# EAGLE schematic driver ckt_4_bjtTH (EAGLE 8.4.3)
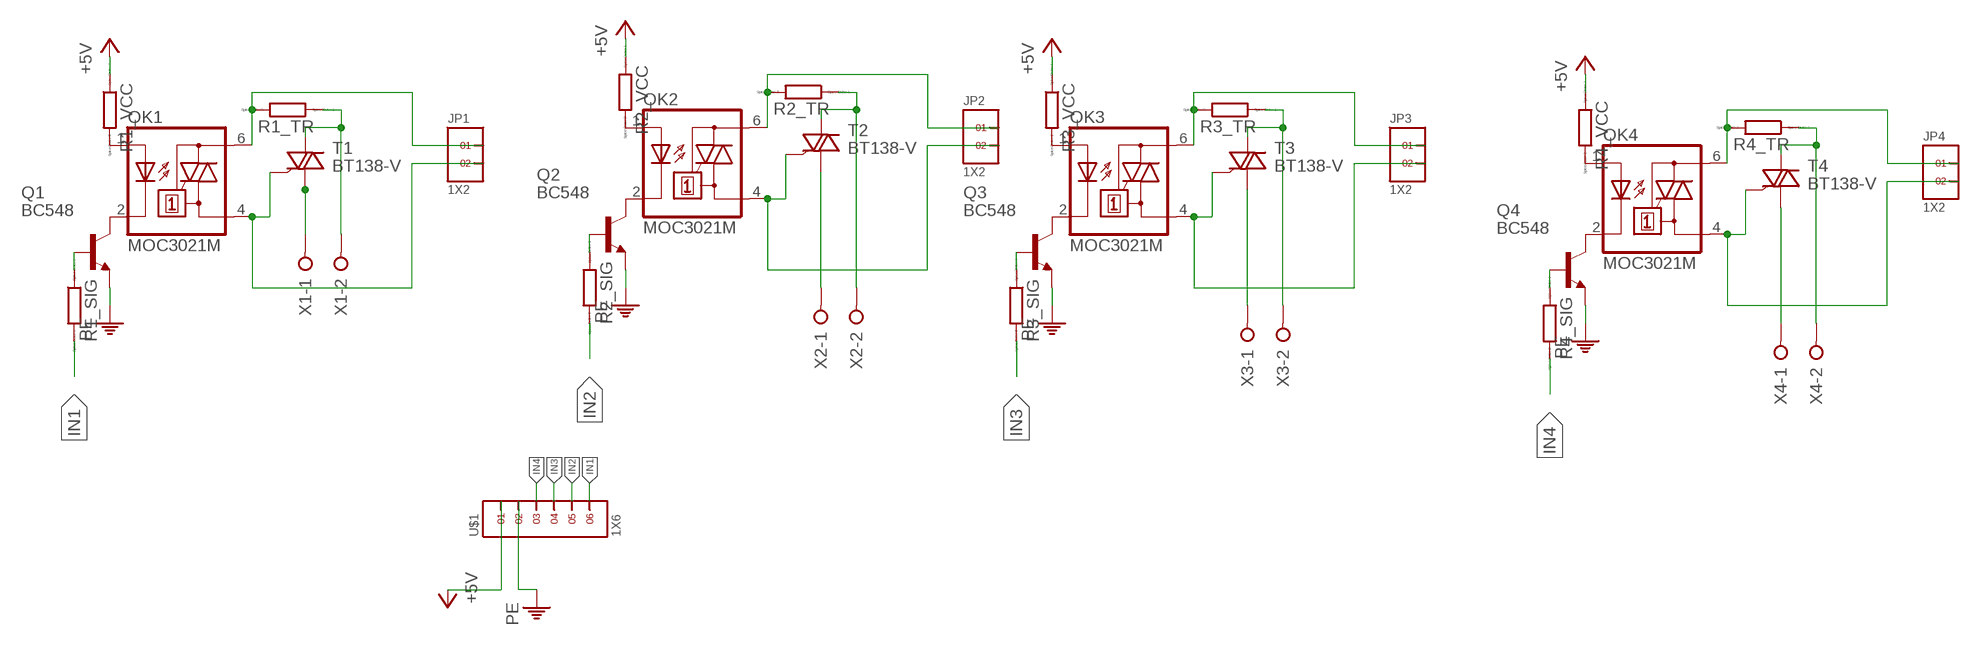
[diagram p0: schematic, sheet 1]

## Parts
JP1  1X2  [1X2]
JP2  1X2  [1X2]
JP3  1X2  [1X2]
JP4  1X2  [1X2]
OK1  MOC3021M  [DIL06]
OK2  MOC3021M  [DIL06]
OK3  MOC3021M  [DIL06]
OK4  MOC3021M  [DIL06]
Q1  BC548  [TO92-EBC]
Q2  BC548  [TO92-EBC]
Q3  BC548  [TO92-EBC]
Q4  BC548  [TO92-EBC]
R1_SIG  RR1206  [R1206]
R1_TR  RR1206  [R1206]
R1_VCC  RR1206  [R1206]
R2_SIG  RR1206  [R1206]
R2_TR  RR1206  [R1206]
R2_VCC  RR1206  [R1206]
R3_SIG  RR1206  [R1206]
R3_TR  RR1206  [R1206]
R3_VCC  RR1206  [R1206]
R4_SIG  RR1206  [R1206]
R4_TR  RR1206  [R1206]
R4_VCC  RR1206  [R1206]
T1  BT138-V  [TO220BV]
T2  BT138-V  [TO220BV]
T3  BT138-V  [TO220BV]
T4  BT138-V  [TO220BV]
U$1  1X6  [1X6]
X1  W237-02P  [W237-132]
X2  W237-02P  [W237-132]
X3  W237-02P  [W237-132]
X4  W237-02P  [W237-132]

## Nets
+5V: R1_VCC.1 R2_VCC.1 R3_VCC.1 R4_VCC.1 U$1.1
IN1: R1_SIG.2 U$1.6
IN2: R2_SIG.2 U$1.5
IN3: R3_SIG.2 U$1.4
IN4: R4_SIG.2 U$1.3
N$1: JP1.1 OK1.6(A2) R1_TR.2
N$2: R1_TR.1 T1.T2(A2) X1.2
N$3: T1.T1(A1) X1.1
N$4: OK1.1(A) R1_VCC.2
N$5: OK1.2(C) Q1.C
N$6: JP2.2 OK2.4(A1) T2.G
N$7: JP1.2 OK1.4(A1) T1.G
N$8: JP2.1 OK2.6(A2) R2_TR.2
N$9: Q1.B R1_SIG.1
N$10: R2_TR.1 T2.T2(A2) X2.2
N$11: Q2.B R2_SIG.1
N$12: T2.T1(A1) X2.1
N$13: OK2.1(A) R2_VCC.2
N$14: OK2.2(C) Q2.C
N$15: JP3.2 OK3.4(A1) T3.G
N$16: JP3.1 OK3.6(A2) R3_TR.2
N$17: R3_TR.1 T3.T2(A2) X3.2
N$18: Q3.B R3_SIG.1
N$19: T3.T1(A1) X3.1
N$20: OK3.1(A) R3_VCC.2
N$21: OK3.2(C) Q3.C
N$22: JP4.2 OK4.4(A1) T4.G
N$23: JP4.1 OK4.6(A2) R4_TR.2
N$24: R4_TR.1 T4.T2(A2) X4.2
N$25: Q4.B R4_SIG.1
N$26: T4.T1(A1) X4.1
N$27: OK4.1(A) R4_VCC.2
N$28: OK4.2(C) Q4.C
PE: Q1.E Q2.E Q3.E Q4.E U$1.2

## Library data of the parts
JP1-JP4 = headers(2mm):1X2
OK1-OK4 = optocoupler:MOC30*M: RANDOM-PHASE OPTOISOLATORS TRIAC DRIVER OUTPUT Source: http://www.fairchildsemi.com MOC3020-M.pdf; MF: FAIRCHILD SEMICONDUCTOR; MPN: MOC3021-M; OC_FARNELL: 1021365; OC_NEWARK: 95B7895
Q1-Q4 = transistor-npn:BC548*: NPN Transistor
R1_SIG R1_TR R1_VCC R2_SIG R2_TR R2_VCC R3_SIG R3_TR R3_VCC R4_SIG R4_TR R4_VCC = eagle-ltspice:R: RESISTOR, European symbol; SPICEMODEL: NONE; SPICEPREFIX: R
T1-T4 = triac:BT138: TRIAC Source: http://www.semiconductors.philips.com BT138_SERIES_2.pdf
U$1 = headers(2mm):1X6
X1-X4 = con-wago-508:W237-02P: WAGO SREW CLAMP; OC_FARNELL: unknown; OC_NEWARK: unknown